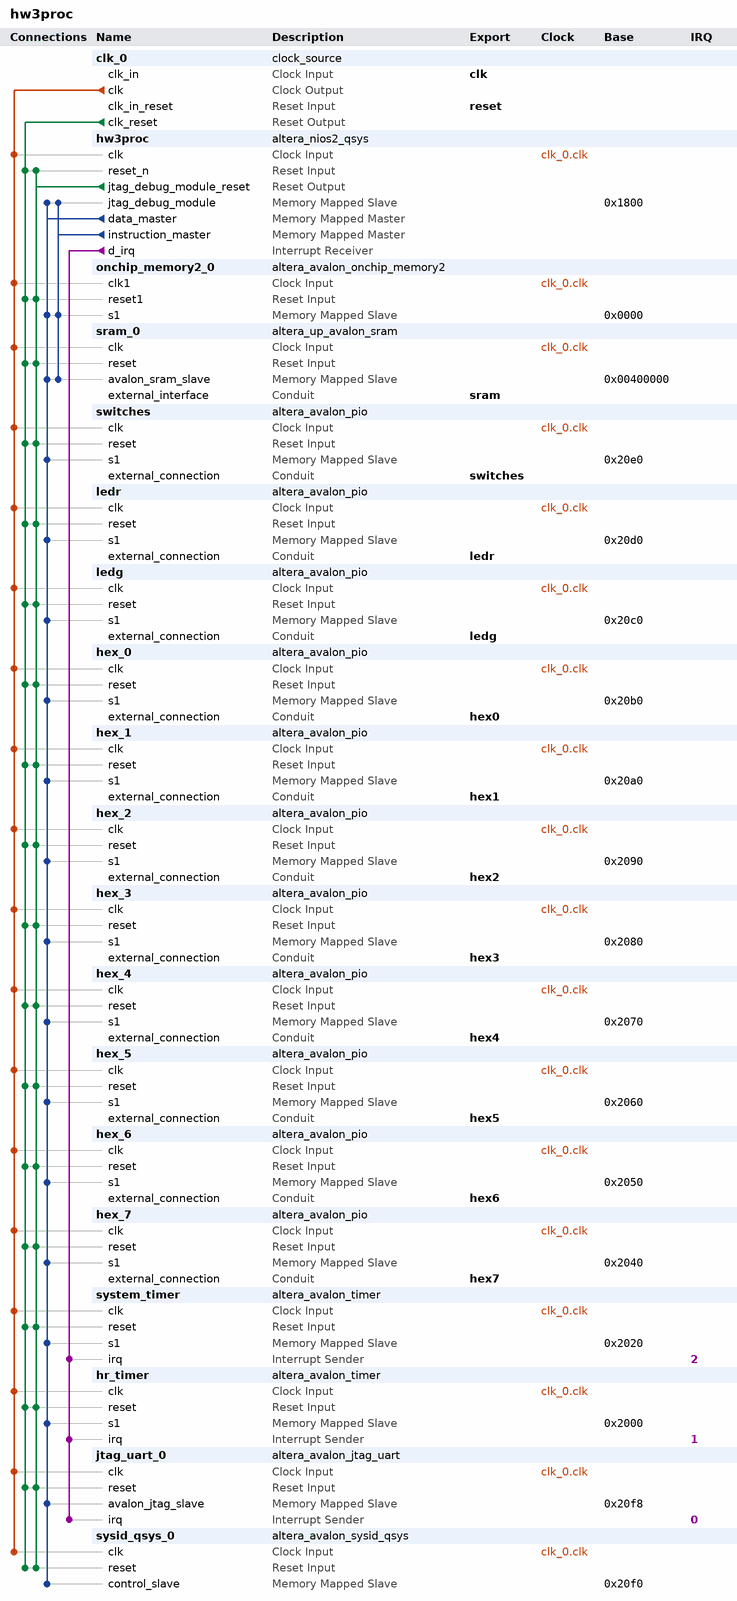
[diagram p0: system contents]
# Platform Designer (Qsys) system hw3proc, Cyclone IV E EP4CE115F29C7
# Parameters at their usual value, and those the tool derives, are not listed.
package require -exact qsys 17.1
create_system hw3proc
set_project_property DEVICE_FAMILY {Cyclone IV E}
set_project_property DEVICE EP4CE115F29C7

add_instance clk_0 clock_source 17.1
set_instance_parameter_value clk_0 clockFrequency 50000000

add_instance hw3proc altera_nios2_qsys 16.1
set_instance_parameter_value hw3proc breakSlave hw3proc.jtag_debug_module
set_instance_parameter_value hw3proc exceptionSlave onchip_memory2_0.s1
set_instance_parameter_value hw3proc icache_size 4096
set_instance_parameter_value hw3proc impl Fast
set_instance_parameter_value hw3proc mmu_TLBMissExcSlave None
set_instance_parameter_value hw3proc resetSlave onchip_memory2_0.s1
set_instance_parameter_value hw3proc resetrequest_enabled true

add_instance onchip_memory2_0 altera_avalon_onchip_memory2 17.1
set_instance_parameter_value onchip_memory2_0 dataWidth 32
set_instance_parameter_value onchip_memory2_0 dualPort false
set_instance_parameter_value onchip_memory2_0 initMemContent true
set_instance_parameter_value onchip_memory2_0 initializationFileName onchip_mem.hex
set_instance_parameter_value onchip_memory2_0 memorySize 4096

add_instance sram_0 altera_up_avalon_sram 17.1
set_instance_parameter_value sram_0 board DE2-115
set_instance_parameter_value sram_0 pixel_buffer false

add_instance switches altera_avalon_pio 17.1
set_instance_parameter_value switches direction Input
set_instance_parameter_value switches width 18

add_instance ledr altera_avalon_pio 17.1
set_instance_parameter_value ledr direction Output
set_instance_parameter_value ledr width 18

add_instance ledg altera_avalon_pio 17.1
set_instance_parameter_value ledg direction Output
set_instance_parameter_value ledg width 8

add_instance hex_0 altera_avalon_pio 17.1
set_instance_parameter_value hex_0 direction Output
set_instance_parameter_value hex_0 width 7

add_instance hex_1 altera_avalon_pio 17.1
set_instance_parameter_value hex_1 direction Output
set_instance_parameter_value hex_1 width 7

add_instance hex_2 altera_avalon_pio 17.1
set_instance_parameter_value hex_2 direction Output
set_instance_parameter_value hex_2 width 7

add_instance hex_3 altera_avalon_pio 17.1
set_instance_parameter_value hex_3 direction Output
set_instance_parameter_value hex_3 width 7

add_instance hex_4 altera_avalon_pio 17.1
set_instance_parameter_value hex_4 direction Output
set_instance_parameter_value hex_4 width 7

add_instance hex_5 altera_avalon_pio 17.1
set_instance_parameter_value hex_5 direction Output
set_instance_parameter_value hex_5 width 7

add_instance hex_6 altera_avalon_pio 17.1
set_instance_parameter_value hex_6 direction Output
set_instance_parameter_value hex_6 width 7

add_instance hex_7 altera_avalon_pio 17.1
set_instance_parameter_value hex_7 direction Output
set_instance_parameter_value hex_7 width 7

add_instance system_timer altera_avalon_timer 17.1
set_instance_parameter_value system_timer period 1
set_instance_parameter_value system_timer periodUnits MSEC

add_instance hr_timer altera_avalon_timer 17.1
set_instance_parameter_value hr_timer period 1
set_instance_parameter_value hr_timer periodUnits MSEC

add_instance jtag_uart_0 altera_avalon_jtag_uart 17.1
set_instance_parameter_value jtag_uart_0 simInteractiveOptions NO_INTERACTIVE_WINDOWS

add_instance sysid_qsys_0 altera_avalon_sysid_qsys 17.1
set_instance_parameter_value sysid_qsys_0 id 0

# connections
add_connection clk_0.clk hex_0.clk clock
add_connection clk_0.clk hex_1.clk clock
add_connection clk_0.clk hex_2.clk clock
add_connection clk_0.clk hex_3.clk clock
add_connection clk_0.clk hex_4.clk clock
add_connection clk_0.clk hex_5.clk clock
add_connection clk_0.clk hex_6.clk clock
add_connection clk_0.clk hex_7.clk clock
add_connection clk_0.clk hr_timer.clk clock
add_connection clk_0.clk hw3proc.clk clock
add_connection clk_0.clk jtag_uart_0.clk clock
add_connection clk_0.clk ledg.clk clock
add_connection clk_0.clk ledr.clk clock
add_connection clk_0.clk onchip_memory2_0.clk1 clock
add_connection clk_0.clk sram_0.clk clock
add_connection clk_0.clk switches.clk clock
add_connection clk_0.clk sysid_qsys_0.clk clock
add_connection clk_0.clk system_timer.clk clock
add_connection clk_0.clk_reset hex_0.reset reset
add_connection clk_0.clk_reset hex_1.reset reset
add_connection clk_0.clk_reset hex_2.reset reset
add_connection clk_0.clk_reset hex_3.reset reset
add_connection clk_0.clk_reset hex_4.reset reset
add_connection clk_0.clk_reset hex_5.reset reset
add_connection clk_0.clk_reset hex_6.reset reset
add_connection clk_0.clk_reset hex_7.reset reset
add_connection clk_0.clk_reset hr_timer.reset reset
add_connection clk_0.clk_reset hw3proc.reset_n reset
add_connection clk_0.clk_reset jtag_uart_0.reset reset
add_connection clk_0.clk_reset ledg.reset reset
add_connection clk_0.clk_reset ledr.reset reset
add_connection clk_0.clk_reset onchip_memory2_0.reset1 reset
add_connection clk_0.clk_reset sram_0.reset reset
add_connection clk_0.clk_reset switches.reset reset
add_connection clk_0.clk_reset sysid_qsys_0.reset reset
add_connection clk_0.clk_reset system_timer.reset reset
add_connection hw3proc.jtag_debug_module_reset hex_0.reset reset
add_connection hw3proc.jtag_debug_module_reset hex_1.reset reset
add_connection hw3proc.jtag_debug_module_reset hex_2.reset reset
add_connection hw3proc.jtag_debug_module_reset hex_3.reset reset
add_connection hw3proc.jtag_debug_module_reset hex_4.reset reset
add_connection hw3proc.jtag_debug_module_reset hex_5.reset reset
add_connection hw3proc.jtag_debug_module_reset hex_6.reset reset
add_connection hw3proc.jtag_debug_module_reset hex_7.reset reset
add_connection hw3proc.jtag_debug_module_reset hr_timer.reset reset
add_connection hw3proc.jtag_debug_module_reset hw3proc.reset_n reset
add_connection hw3proc.jtag_debug_module_reset jtag_uart_0.reset reset
add_connection hw3proc.jtag_debug_module_reset ledg.reset reset
add_connection hw3proc.jtag_debug_module_reset ledr.reset reset
add_connection hw3proc.jtag_debug_module_reset onchip_memory2_0.reset1 reset
add_connection hw3proc.jtag_debug_module_reset sram_0.reset reset
add_connection hw3proc.jtag_debug_module_reset switches.reset reset
add_connection hw3proc.jtag_debug_module_reset sysid_qsys_0.reset reset
add_connection hw3proc.jtag_debug_module_reset system_timer.reset reset
add_connection hw3proc.data_master hex_0.s1 avalon
set_connection_parameter_value hw3proc.data_master/hex_0.s1 baseAddress 0x20b0
add_connection hw3proc.data_master hex_1.s1 avalon
set_connection_parameter_value hw3proc.data_master/hex_1.s1 baseAddress 0x20a0
add_connection hw3proc.data_master hex_2.s1 avalon
set_connection_parameter_value hw3proc.data_master/hex_2.s1 baseAddress 0x2090
add_connection hw3proc.data_master hex_3.s1 avalon
set_connection_parameter_value hw3proc.data_master/hex_3.s1 baseAddress 0x2080
add_connection hw3proc.data_master hex_4.s1 avalon
set_connection_parameter_value hw3proc.data_master/hex_4.s1 baseAddress 0x2070
add_connection hw3proc.data_master hex_5.s1 avalon
set_connection_parameter_value hw3proc.data_master/hex_5.s1 baseAddress 0x2060
add_connection hw3proc.data_master hex_6.s1 avalon
set_connection_parameter_value hw3proc.data_master/hex_6.s1 baseAddress 0x2050
add_connection hw3proc.data_master hex_7.s1 avalon
set_connection_parameter_value hw3proc.data_master/hex_7.s1 baseAddress 0x2040
add_connection hw3proc.data_master hr_timer.s1 avalon
set_connection_parameter_value hw3proc.data_master/hr_timer.s1 baseAddress 0x2000
add_connection hw3proc.data_master hw3proc.jtag_debug_module avalon
set_connection_parameter_value hw3proc.data_master/hw3proc.jtag_debug_module baseAddress 0x1800
add_connection hw3proc.data_master jtag_uart_0.avalon_jtag_slave avalon
set_connection_parameter_value hw3proc.data_master/jtag_uart_0.avalon_jtag_slave baseAddress 0x20f8
add_connection hw3proc.data_master ledg.s1 avalon
set_connection_parameter_value hw3proc.data_master/ledg.s1 baseAddress 0x20c0
add_connection hw3proc.data_master ledr.s1 avalon
set_connection_parameter_value hw3proc.data_master/ledr.s1 baseAddress 0x20d0
add_connection hw3proc.data_master onchip_memory2_0.s1 avalon
set_connection_parameter_value hw3proc.data_master/onchip_memory2_0.s1 baseAddress 0x0000
add_connection hw3proc.data_master sram_0.avalon_sram_slave avalon
set_connection_parameter_value hw3proc.data_master/sram_0.avalon_sram_slave baseAddress 0x00400000
add_connection hw3proc.data_master switches.s1 avalon
set_connection_parameter_value hw3proc.data_master/switches.s1 baseAddress 0x20e0
add_connection hw3proc.data_master sysid_qsys_0.control_slave avalon
set_connection_parameter_value hw3proc.data_master/sysid_qsys_0.control_slave baseAddress 0x20f0
add_connection hw3proc.data_master system_timer.s1 avalon
set_connection_parameter_value hw3proc.data_master/system_timer.s1 baseAddress 0x2020
add_connection hw3proc.instruction_master hw3proc.jtag_debug_module avalon
set_connection_parameter_value hw3proc.instruction_master/hw3proc.jtag_debug_module baseAddress 0x1800
add_connection hw3proc.instruction_master onchip_memory2_0.s1 avalon
set_connection_parameter_value hw3proc.instruction_master/onchip_memory2_0.s1 baseAddress 0x0000
add_connection hw3proc.instruction_master sram_0.avalon_sram_slave avalon
set_connection_parameter_value hw3proc.instruction_master/sram_0.avalon_sram_slave baseAddress 0x00400000
add_connection hw3proc.d_irq hr_timer.irq interrupt
set_connection_parameter_value hw3proc.d_irq/hr_timer.irq irqNumber 1
add_connection hw3proc.d_irq jtag_uart_0.irq interrupt
set_connection_parameter_value hw3proc.d_irq/jtag_uart_0.irq irqNumber 0
add_connection hw3proc.d_irq system_timer.irq interrupt
set_connection_parameter_value hw3proc.d_irq/system_timer.irq irqNumber 2

# exported interfaces
add_interface clk clock sink
set_interface_property clk EXPORT_OF clk_0.clk_in
add_interface hex0 conduit end
set_interface_property hex0 EXPORT_OF hex_0.external_connection
add_interface hex1 conduit end
set_interface_property hex1 EXPORT_OF hex_1.external_connection
add_interface hex2 conduit end
set_interface_property hex2 EXPORT_OF hex_2.external_connection
add_interface hex3 conduit end
set_interface_property hex3 EXPORT_OF hex_3.external_connection
add_interface hex4 conduit end
set_interface_property hex4 EXPORT_OF hex_4.external_connection
add_interface hex5 conduit end
set_interface_property hex5 EXPORT_OF hex_5.external_connection
add_interface hex6 conduit end
set_interface_property hex6 EXPORT_OF hex_6.external_connection
add_interface hex7 conduit end
set_interface_property hex7 EXPORT_OF hex_7.external_connection
add_interface ledg conduit end
set_interface_property ledg EXPORT_OF ledg.external_connection
add_interface ledr conduit end
set_interface_property ledr EXPORT_OF ledr.external_connection
add_interface reset reset sink
set_interface_property reset EXPORT_OF clk_0.clk_in_reset
add_interface sram conduit end
set_interface_property sram EXPORT_OF sram_0.external_interface
add_interface switches conduit end
set_interface_property switches EXPORT_OF switches.external_connection

set_interconnect_requirement {$system} qsys_mm.clockCrossingAdapter HANDSHAKE
set_interconnect_requirement {$system} qsys_mm.enableEccProtection FALSE
set_interconnect_requirement {$system} qsys_mm.insertDefaultSlave FALSE
set_interconnect_requirement {$system} qsys_mm.maxAdditionalLatency 1

save_system hw3proc.qsys
